# Altium schematic sheet DUT.SchDoc
size A4
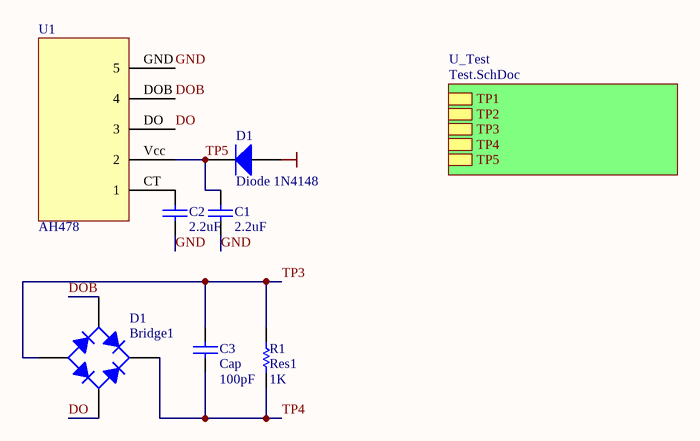
[diagram p0: DUT.SchDoc]

## Parts
(Parts that share a designator on the sheet are numbered #1, #2 ... from top to bottom, then left to right.)
C1  value 2.2uF  [CC1310-0504]  (hidden comment: Cap Semi)
C2  value 2.2uF  [CC1310-0504]  (hidden comment: Cap Semi)
C3  Cap  value 100pF  [RAD-0.3]
D1#1  Diode 1N4148  [DIO7.1-3.9x1.9]
D1#2  Bridge1  [E-BIP-P4/D10]
R1  Res1  value 1K  [AXIAL-0.3]
U1  AH478

## Sub-sheets
U_Test = Test.SchDoc: TP1, TP2, TP3, TP4, TP5

## Nets
+14V: D1#1.1(A)
DO: D1#2.4(C) U1.DO(3)
DOB: D1#2.2(C) U1.DOB(4)
GND: C1.1 C2.1 U1.GND(5)
TP3: C3.2 D1#2.1(A) R1.2
TP4: C3.1 D1#2.3(K) R1.1
TP5: C1.2 D1#1.2(K) U1.Vcc(2)
NetC2_2: C2.2 U1.CT(1)

## Library data of the parts
C1 C2 = Cap Semi: Capacitor (Semiconductor SIM Model); Published: 8-Jun-2000; Revision: July-2002: Re-released for DXP Platform.; Publisher: Altium Limited
C3 = Cap: Capacitor; Published: 8-Jun-2000; Revision: July-2002: Re-released for DXP Platform.; Publisher: Altium Limited
D1#1 = Diode 1N4148: High Conductance Fast Diode; Revision 1: 11-Jul-2000: SIM Model Added.; Revision 2: 17-Jul-2002: Re-released for DXP Platform.; Code - JEDEC: DO-204-AH; Published: 8-Jun-2000; Datasheet: Latest Revision: 1997; Package Reference: DO-35; Publisher: Altium Limited
D1#2 = Bridge1: Full Wave Diode Bridge; Published: 8-Jun-2000; Revision: July-2002: Re-released for DXP Platform.; Publisher: Altium Limited
R1 = Res1: Resistor; Published: 8-Jun-2000; Revision: July-2002: Re-released for DXP Platform.; Publisher: Altium Limited